# EasyEDA schematic Sheet_1.json
TITLE: Sheet_1; REV: 1.0; Date: 2024-08-13; Sheet: 1/1; Drawn By: k754a; Company: Your Company
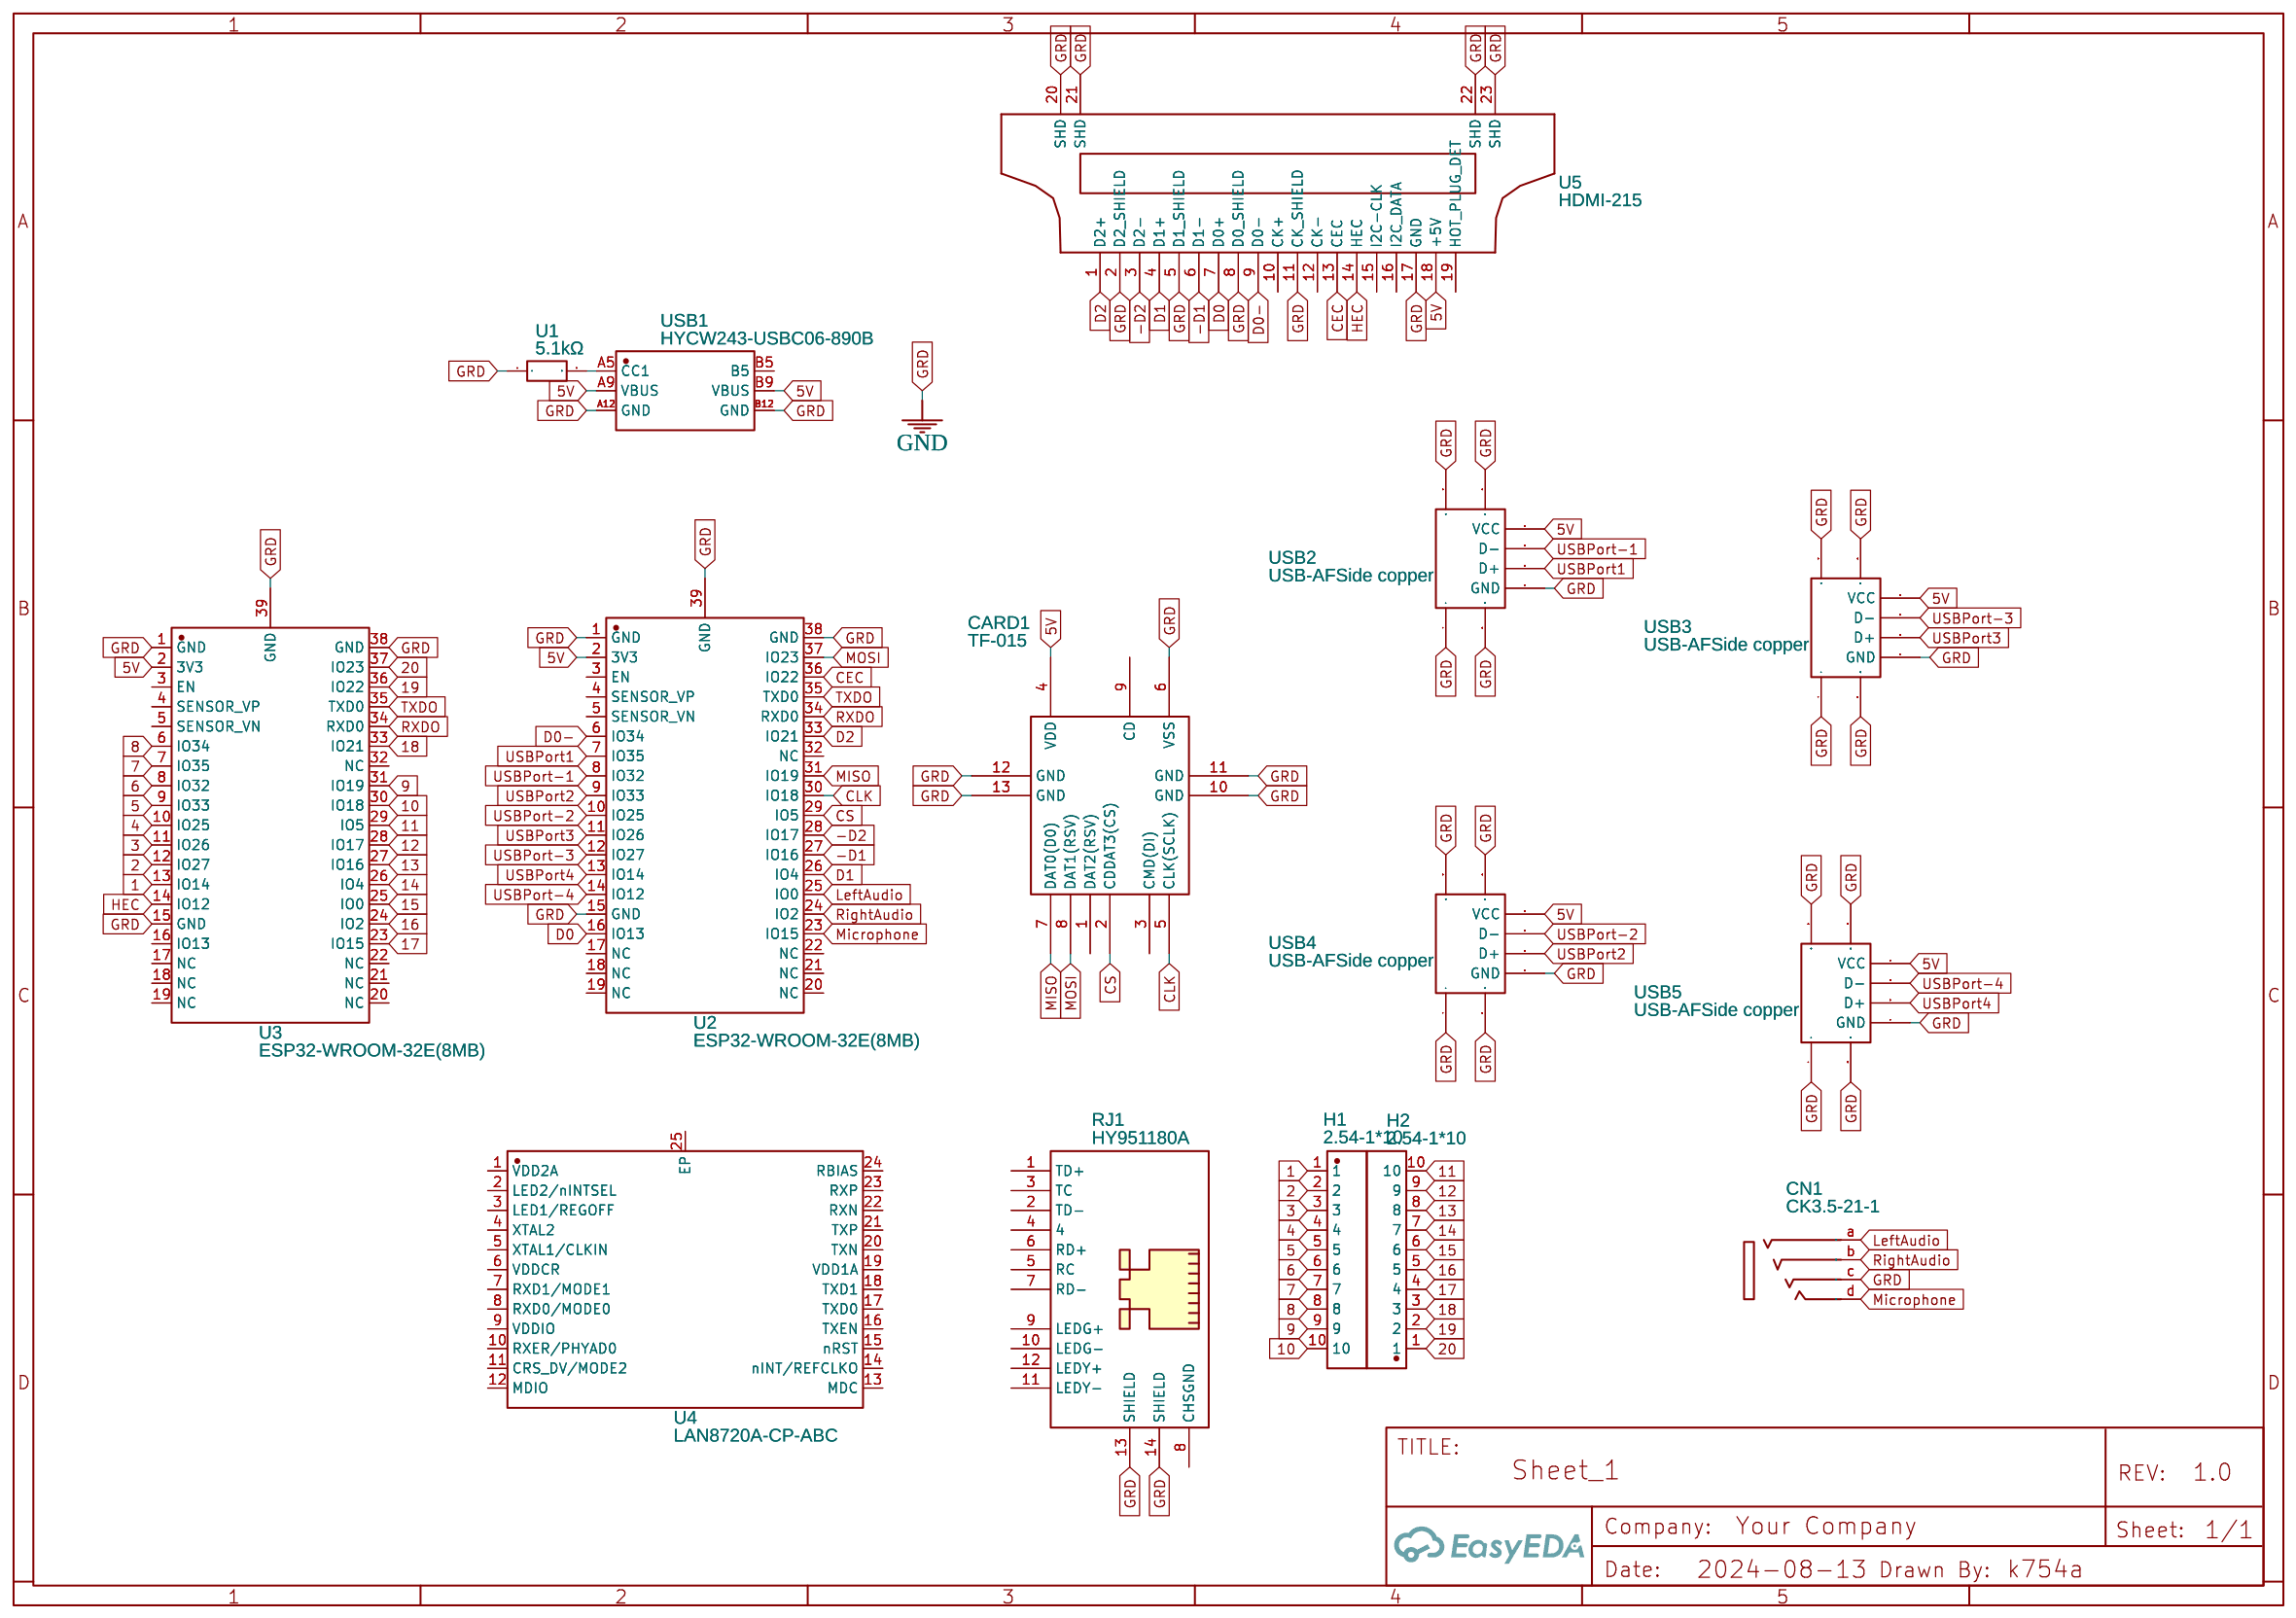
[diagram p0: schematic sheet]

## Parts
CARD1  TF-015  [TF-SMD_TF-015]
CN1  CK3.5-21-1  [AUDIO-SMD_CK3.5-21-1]
H1  2.54-1*10  [HDR-TH_10P-P2.54-V-M]
H2  2.54-1*10  [HDR-TH_10P-P2.54-V-M]
RJ1  HY951180A  [RJ45-TH_HY951180A]
U1  5.1kΩ  [RES-TH_BD2.3-L3.7-P7.70-D0.4]
U2  ESP32-WROOM-32E(8MB)  [WIFI-SMD_ESP32-WROOM-32E]
U3  ESP32-WROOM-32E(8MB)  [WIFI-SMD_ESP32-WROOM-32E]
U4  LAN8720A-CP-ABC  [QFN-24_L4.0-W4.0-P0.50-BL-EP2.5]
U5  HDMI-215  [HDMI-A-SMD_HDMI-215]
USB1  HYCW243-USBC06-890B  [USB-TYPE-C_6P_HYCW243-USBC06-890B]
USB2  USB-AFSide copper  [USB-A-TH_USB-M-2_C26235]
USB3  USB-AFSide copper  [USB-A-TH_USB-M-2_C26235]
USB4  USB-AFSide copper  [USB-A-TH_USB-M-2_C26235]
USB5  USB-AFSide copper  [USB-A-TH_USB-M-2_C26235]

## Library data of the parts
CARD1 = TF-015: Supplier: LCSC; Manufacturer: SOFNG(硕方); Supplier Part: C113206; JLCPCB Part Class: Extended Part
CN1 = CK3.5-21-1: Contributor: LCSC; Supplier: LCSC; Supplier Part: C718047; Manufacturer: JINJIA(金佳); JLCPCB Part Class: Extended Part
H1 H2 = 2.54-1*10: Contributor: lcsc; Supplier: LCSC; Supplier Part: C5156617; Manufacturer: ZHOURI(洲日); JLCPCB Part Class: Extended Part
RJ1 = HY951180A: Contributor: LCSC; Supplier: LCSC; Manufacturer: HANRUN(汉仁); Supplier Part: C34677; JLCPCB Part Class: Extended Part
U1 = CR1/8W-5K1±5%-ST52: Contributor: lcsc; Supplier: LCSC; Supplier Part: C2897081; Manufacturer: VO(翔胜); JLCPCB Part Class: Extended Part
U2 U3 = ESP32-WROOM-32E(8MB): Contributor: LCSC; Supplier: LCSC; Supplier Part: C701342; Manufacturer: ESPRESSIF(乐鑫); Manufacturer Part: ESP32-WROOM-32E-N8; JLCPCB Part Class: Extended Part
U4 = LAN8720A-CP-ABC: Contributor: lcsc; Supplier: LCSC; Supplier Part: C633281; Manufacturer: MICROCHIP(美国微芯); JLCPCB Part Class: Extended Part
U5 = HDMI-215: Supplier: LCSC; Supplier Part: C2962411; Manufacturer: HANBO(汉博); JLCPCB Part Class: Extended Part; Contributor: lcsc
USB1 = HYCW243-USBC06-890B: Contributor: lcsc; Supplier: LCSC; Supplier Part: C3034192; Manufacturer: 华宇创; JLCPCB Part Class: Extended Part
USB2-USB5 = USB-AFSide copper: Supplier: LCSC; Manufacturer: 精拓金; Manufacturer Part: USB-AF侧插铜; Supplier Part: C26235; JLCPCB Part Class: Extended Part

## Nets
5V: CARD1.4(VDD) U2.2(3V3) U3.2(3V3) U5.18(+5V) USB1.A9(VBUS) USB1.B9(VBUS) USB2.1(VCC) USB3.1(VCC) USB4.1(VCC) USB5.1(VCC)
GND: CARD1.6(VSS) CARD1.10(GND) CARD1.11(GND) CARD1.12(GND) CARD1.13(GND) CN1.c RJ1.13(SHIELD) RJ1.14(SHIELD) U1.1 U2.1(GND) U2.15(GND) U2.38(GND) U2.39(GND) U3.1(GND) U3.15(GND) U3.38(GND) U3.39(GND) U5.2(D2_SHIELD) U5.5(D1_SHIELD) U5.8(D0_SHIELD) U5.11(CK_SHIELD) U5.17(GND) U5.20(SHD) U5.21(SHD) U5.22(SHD) U5.23(SHD) USB1.A12(GND) USB1.B12(GND) USB2.4(GND) USB2.5 USB2.6 USB2.7 USB2.8 USB3.4(GND) USB3.5 USB3.6 USB3.7 USB3.8 USB4.4(GND) USB4.5 USB4.6 USB4.7 USB4.8 USB5.4(GND) USB5.5 USB5.6 USB5.7 USB5.8
1: H1.1 U3.13(IO14)
2: H1.2 U3.12(IO27)
3: H1.3 U3.11(IO26)
4: H1.4 U3.10(IO25)
5: H1.5 U3.9(IO33)
6: H1.6 U3.8(IO32)
7: H1.7 U3.7(IO35)
8: H1.8 U3.6(IO34)
9: H1.9 U3.31(IO19)
10: H1.10 U3.30(IO18)
11: H2.10 U3.29(IO5)
12: H2.9 U3.28(IO17)
13: H2.8 U3.27(IO16)
14: H2.7 U3.26(IO4)
15: H2.6 U3.25(IO0)
16: H2.5 U3.24(IO2)
17: H2.4 U3.23(IO15)
18: H2.3 U3.33(IO21)
19: H2.2 U3.36(IO22)
20: H2.1 U3.37(IO23)
-D1: U2.27(IO16) U5.6(D1-)
-D2: U2.28(IO17) U5.3(D2-)
CEC: U2.36(IO22) U5.13(CEC)
CLK: CARD1.5(CLK(SCLK)) U2.30(IO18)
CS: CARD1.2(CDDAT3(CS)) U2.29(IO5)
D0: U2.16(IO13) U5.7(D0+)
D0-: U2.6(IO34) U5.9(D0-)
D1: U2.26(IO4) U5.4(D1+)
D2: U2.33(IO21) U5.1(D2+)
HEC: U3.14(IO12) U5.14(HEC)
LeftAudio: CN1.a U2.25(IO0)
Microphone: CN1.d U2.23(IO15)
MISO: CARD1.7(DAT0(D0)) U2.31(IO19)
MOSI: CARD1.8(DAT1(RSV)) U2.37(IO23)
RightAudio: CN1.b U2.24(IO2)
RXDO: U2.34(RXD0) U3.34(RXD0)
TXDO: U2.35(TXD0) U3.35(TXD0)
USBPort1: U2.7(IO35) USB2.3(D+)
USBPort2: U2.9(IO33) USB4.3(D+)
USBPort3: U2.11(IO26) USB3.3(D+)
USBPort4: U2.13(IO14) USB5.3(D+)
USBPort-1: U2.8(IO32) USB2.2(D-)
USBPort-2: U2.10(IO25) USB4.2(D-)
USBPort-3: U2.12(IO27) USB3.2(D-)
USBPort-4: U2.14(IO12) USB5.2(D-)
Net-(U1-2): U1.2 USB1.A5(CC1)

Not connected (* = marked no-connect by the designer): CARD1 1(DAT2(RSV)) 3(CMD(DI)) 9(CD); RJ1 1(TD+) 2(TD-) 3(TC) 4 5(RC) 6(RD+) 7(RD-) 8(CHSGND) 9(LEDG+) 10(LEDG-) 11(LEDY-) 12(LEDY+); U2 3(EN) 4(SENSOR_VP) 5(SENSOR_VN) 17(NC) 18(NC) 19(NC) 20(NC) 21(NC) 22(NC) 32(NC); U3 3(EN) 4(SENSOR_VP) 5(SENSOR_VN) 16(IO13) 17(NC) 18(NC) 19(NC) 20(NC) 21(NC) 22(NC) 32(NC); U4 1(VDD2A) 2(LED2/nINTSEL) 3(LED1/REGOFF) 4(XTAL2) 5(XTAL1/CLKIN) 6(VDDCR) 7(RXD1/MODE1) 8(RXD0/MODE0) 9(VDDIO) 10(RXER/PHYAD0) 11(CRS_DV/MODE2) 12(MDIO) 13(MDC) 14(nINT/REFCLKO) 15(nRST) 16(TXEN) 17(TXD0) 18(TXD1) 19(VDD1A) 20(TXN) 21(TXP) 22(RXN) 23(RXP) 24(RBIAS) 25(EP); U5 10(CK+) 12(CK-) 15(I2C-CLK) 16(I2C_DATA) 19(HOT_PLUG_DET); USB1 B5
